# Altium schematic sheet main.SchDoc
size C; Organization: Altium Limited; Address1: L3, 12a Rodborough Rd; Address2: Frenchs Forest; Address3: NSW; Address4: Australia 2086
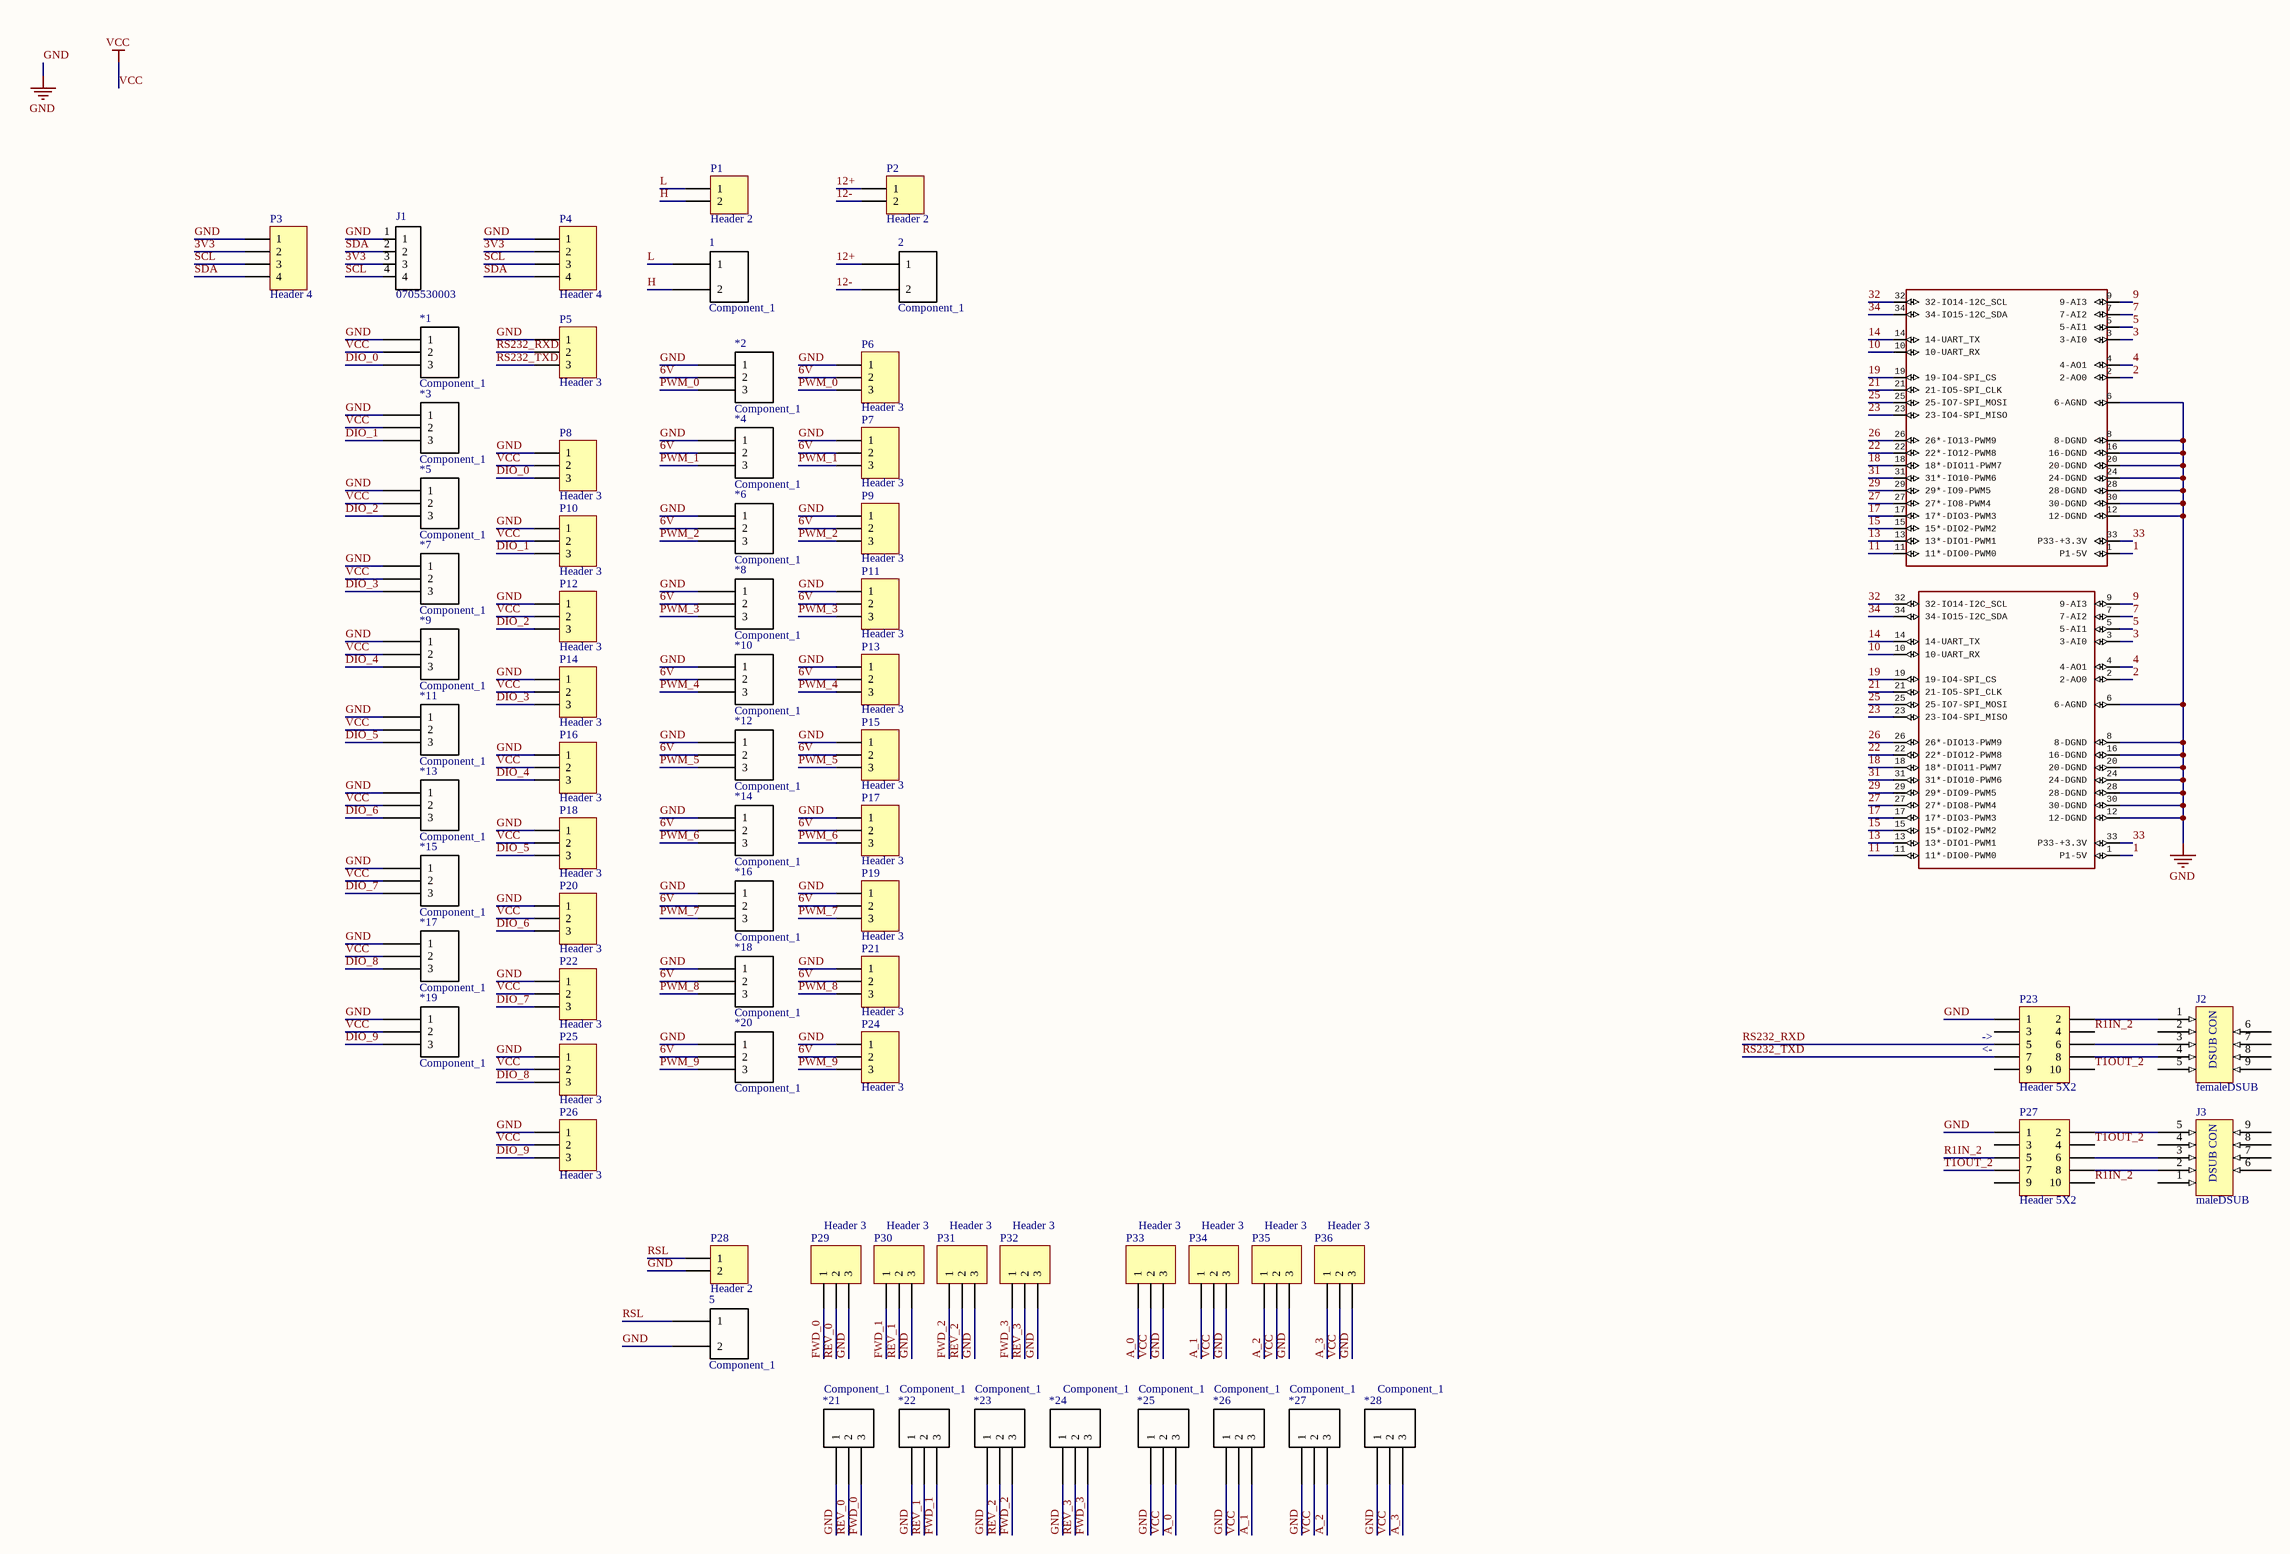
[diagram p0: main.SchDoc]

## Parts
1  Component_1  [2pinmolex]
2  Component_1  [2pinmolex]
3  RREXTENSION-MALE  [RREXT-MALE]  (value not drawn)
4  RRINTERFACE-FEMALE  [RRINT-FEMALE]  (value not drawn)
5  Component_1  [2pinmolex]
*1  Component_1  [3pinmolex]
*2  Component_1  [3pinmolex]
*3  Component_1  [3pinmolex]
*4  Component_1  [3pinmolex]
*5  Component_1  [3pinmolex]
*6  Component_1  [3pinmolex]
*7  Component_1  [3pinmolex]
*8  Component_1  [3pinmolex]
*9  Component_1  [3pinmolex]
*10  Component_1  [3pinmolex]
*11  Component_1  [3pinmolex]
*12  Component_1  [3pinmolex]
*13  Component_1  [3pinmolex]
*14  Component_1  [3pinmolex]
*15  Component_1  [3pinmolex]
*16  Component_1  [3pinmolex]
*17  Component_1  [3pinmolex]
*18  Component_1  [3pinmolex]
*19  Component_1  [3pinmolex]
*20  Component_1  [3pinmolex]
*21  Component_1  [3pinmolex]
*22  Component_1  [3pinmolex]
*23  Component_1  [3pinmolex]
*24  Component_1  [3pinmolex]
*25  Component_1  [3pinmolex]
*26  Component_1  [3pinmolex]
*27  Component_1  [3pinmolex]
*28  Component_1  [3pinmolex]
J1  0705530003  [*MOLEX_0705530003]
J2  femaleDSUB  [DSUBfemale]
J3  maleDSUB  [DSUBmale]
P1  Header 2  [HDR1X2]
P2  Header 2  [HDR1X2]
P3  Header 4  [HDR1X4]
P4  Header 4  [HDR1X4]
P5  Header 3  [HDR1X3]
P6  Header 3  [HDR1X3]
P7  Header 3  [HDR1X3]
P8  Header 3  [HDR1X3]
P9  Header 3  [HDR1X3]
P10  Header 3  [HDR1X3]
P11  Header 3  [HDR1X3]
P12  Header 3  [HDR1X3]
P13  Header 3  [HDR1X3]
P14  Header 3  [HDR1X3]
P15  Header 3  [HDR1X3]
P16  Header 3  [HDR1X3]
P17  Header 3  [HDR1X3]
P18  Header 3  [HDR1X3]
P19  Header 3  [HDR1X3]
P20  Header 3  [HDR1X3]
P21  Header 3  [HDR1X3]
P22  Header 3  [HDR1X3]
P23  Header 5X2  [HDR2X5]
P24  Header 3  [HDR1X3]
P25  Header 3  [HDR1X3]
P26  Header 3  [HDR1X3]
P27  Header 5X2  [HDR2X5]
P28  Header 2  [HDR1X2]
P29  Header 3  [HDR1X3]
P30  Header 3  [HDR1X3]
P31  Header 3  [HDR1X3]
P32  Header 3  [HDR1X3]
P33  Header 3  [HDR1X3]
P34  Header 3  [HDR1X3]
P35  Header 3  [HDR1X3]
P36  Header 3  [HDR1X3]

## Nets
GND: 3.6(6-AGND) 3.8(8-DGND) 3.12(12-DGND) 3.16(16-DGND) 3.20(20-DGND) 3.24(24-DGND) 3.28(28-DGND) 3.30(30-DGND) 4.6(6-AGND) 4.8(8-DGND) 4.12(12-DGND) 4.16(16-DGND) 4.20(20-DGND) 4.24(24-DGND) 4.28(28-DGND) 4.30(30-DGND) 5.2 *1.1 *2.1 *3.1 *4.1 *5.1 *6.1 *7.1 *8.1 *9.1 *10.1 *11.1 *12.1 *13.1 *14.1 *15.1 *16.1 *17.1 *18.1 *19.1 *20.1 *21.1 *22.1 *23.1 *24.1 *25.1 *26.1 *27.1 *28.1 J1.1 P3.1 P4.1 P5.1 P6.1 P7.1 P8.1 P9.1 P10.1 P11.1 P12.1 P13.1 P14.1 P15.1 P16.1 P17.1 P18.1 P19.1 P20.1 P21.1 P22.1 P23.1 P24.1 P25.1 P26.1 P27.1 P28.2 P29.3 P30.3 P31.3 P32.3 P33.3 P34.3 P35.3 P36.3
VCC: *1.2 *3.2 *5.2 *7.2 *9.2 *11.2 *13.2 *15.2 *17.2 *19.2 *25.2 *26.2 *27.2 *28.2 P8.2 P10.2 P12.2 P14.2 P16.2 P18.2 P20.2 P22.2 P25.2 P26.2 P33.2 P34.2 P35.2 P36.2
1: 3.1(P1-5V) 4.1(P1-5V)
2: 3.2(2-AO0) 4.2(2-AO0)
3: 3.3(3-AI0) 4.3(3-AI0)
3V3: J1.3 P3.2 P4.2
4: 3.4(4-AO1) 4.4(4-AO1)
5: 3.5(5-AI1) 4.5(5-AI1)
6V: *2.2 *4.2 *6.2 *8.2 *10.2 *12.2 *14.2 *16.2 *18.2 *20.2 P6.2 P7.2 P9.2 P11.2 P13.2 P15.2 P17.2 P19.2 P21.2 P24.2
7: 3.7(7-AI2) 4.7(7-AI2)
9: 3.9(9-AI3) 4.9(9-AI3)
10: 3.10(10-UART_RX) 4.10(10-UART_RX)
11: 3.11(11*-DIO0-PWM0) 4.11(11*-DIO0-PWM0)
12+: 2.1 P2.1
12-: 2.2 P2.2
13: 3.13(13*-DIO1-PWM1) 4.13(13*-DIO1-PWM1)
14: 3.14(14-UART_TX) 4.14(14-UART_TX)
15: 3.15(15*-DIO2-PWM2) 4.15(15*-DIO2-PWM2)
17: 3.17(17*-DIO3-PWM3) 4.17(17*-DIO3-PWM3)
18: 3.18(18*-DIO11-PWM7) 4.18(18*-DIO11-PWM7)
19: 3.19(19-IO4-SPI_CS) 4.19(19-IO4-SPI_CS)
21: 3.21(21-IO5-SPI_CLK) 4.21(21-IO5-SPI_CLK)
22: 3.22(22*-IO12-PWM8) 4.22(22*-DIO12-PWM8)
23: 3.23(23-IO4-SPI_MISO) 4.23(23-IO4-SPI_MISO)
25: 3.25(25-IO7-SPI_MOSI) 4.25(25-IO7-SPI_MOSI)
26: 3.26(26*-IO13-PWM9) 4.26(26*-DIO13-PWM9)
27: 3.27(27*-IO8-PWM4) 4.27(27*-DIO8-PWM4)
29: 3.29(29*-IO9-PWM5) 4.29(29*-DIO9-PWM5)
31: 3.31(31*-IO10-PWM6) 4.31(31*-DIO10-PWM6)
32: 3.32(32-IO14-12C_SCL) 4.32(32-IO14-I2C_SCL)
33: 3.33(P33-+3.3V) 4.33(P33-+3.3V)
34: 3.34(34-IO15-12C_SDA) 4.34(34-IO15-I2C_SDA)
A_0: *25.3 P33.1
A_1: *26.3 P34.1
A_2: *27.3 P35.1
A_3: *28.3 P36.1
DIO_0: *1.3 P8.3
DIO_1: *3.3 P10.3
DIO_2: *5.3 P12.3
DIO_3: *7.3 P14.3
DIO_4: *9.3 P16.3
DIO_5: *11.3 P18.3
DIO_6: *13.3 P20.3
DIO_7: *15.3 P22.3
DIO_8: *17.3 P25.3
DIO_9: *19.3 P26.3
FWD_0: *21.3 P29.1
FWD_1: *22.3 P30.1
FWD_2: *23.3 P31.1
FWD_3: *24.3 P32.1
H: 1.2 P1.2
L: 1.1 P1.1
PWM_0: *2.3 P6.3
PWM_1: *4.3 P7.3
PWM_2: *6.3 P9.3
PWM_3: *8.3 P11.3
PWM_4: *10.3 P13.3
PWM_5: *12.3 P15.3
PWM_6: *14.3 P17.3
PWM_7: *16.3 P19.3
PWM_8: *18.3 P21.3
PWM_9: *20.3 P24.3
R1IN_2: P23.4 P27.5 P27.10
REV_0: *21.2 P29.2
REV_1: *22.2 P30.2
REV_2: *23.2 P31.2
REV_3: *24.2 P32.2
RS232_RXD: P5.2 P23.5
RS232_TXD: P5.3 P23.7
RSL: 5.1 P28.1
SCL: J1.4 P3.3 P4.3
SDA: J1.2 P3.4 P4.4
T1OUT_2: P23.10 P27.4 P27.7
NetJ2_1: J2.1 P23.2
NetJ2_3: J2.3 P23.6
NetJ2_4: J2.4 P23.8
NetJ3_2: J3.2 P27.8
NetJ3_3: J3.3 P27.6
NetJ3_5: J3.5 P27.2

Not connected (* = marked no-connect by the designer): J2 2 5 6 7 8 9; J3 1 4 6 7 8 9; P23 3 9; P27 3 9

## Notes on the sheet
- (near P23) ->
- (near P23) <-
- Title
- Size:
- Date:
- File:
- C
- Number:
- Time:
- Revision:
- Sheet
- of
- (in symbol femaleDSUB) DSUB CON
- (in symbol maleDSUB) DSUB CON

## Library data of the parts
3 = RREXTENSION-MALE: GateName_1: G$2; SymbolName_1: RR_EXTENSION_MALE; LibraryName: RoboRioConnector; DeviceSetName: RREXTENSION-MALE; Package: RREXT-MALE
4 = RRINTERFACE-FEMALE: GateName_1: G$1; SymbolName_1: RR_INTERFACE_FEMALE; LibraryName: RoboRioConnector; DeviceSetName: RRINTERFACE-FEMALE; Package: RRINT-FEMALE
J1 = 0705530003: / Conn Shrouded Header HDR 4 POS 2.54mm Solder RA Thru-Hole SLÃƒÂ¢Ã¢Â€ÂžÂ¢ Tube /; MF: Molex; Package: None; MP: 0705530003; Digi-Key_Purchase_URL: https://www.digikey.com/product-detail/en/molex/0705530003/WM4902-ND/114959?utm_source=snapeda&utm_medium=aggregator&utm_campaign=symbol; SnapEDA_Link: https://www.snapeda.com/parts/0705530003/Molex/view-part/?ref=snap; Digi-Key_Part_Number: WM4902-ND; Value: *
P1 P2 P28 = Header 2: Header, 2-Pin; LatestRevisionDate: 17-Jul-2002; LatestRevisionNote: Re-released for DXP Platform.; Publisher: Altium Limited
P3 P4 = Header 4: Header, 4-Pin; LatestRevisionDate: 17-Jul-2002; LatestRevisionNote: Re-released for DXP Platform.; Publisher: Altium Limited
P5-P22 P24-P26 P29-P36 = Header 3: Header, 3-Pin; LatestRevisionDate: 17-Jul-2002; LatestRevisionNote: Re-released for DXP Platform.; Publisher: Altium Limited
P23 P27 = Header 5X2: Header, 5-Pin, Dual row; LatestRevisionDate: 17-Jul-2002; LatestRevisionNote: Re-released for DXP Platform.; Publisher: Altium Limited